# Altium project INA333信号放大模块.PrjPcb
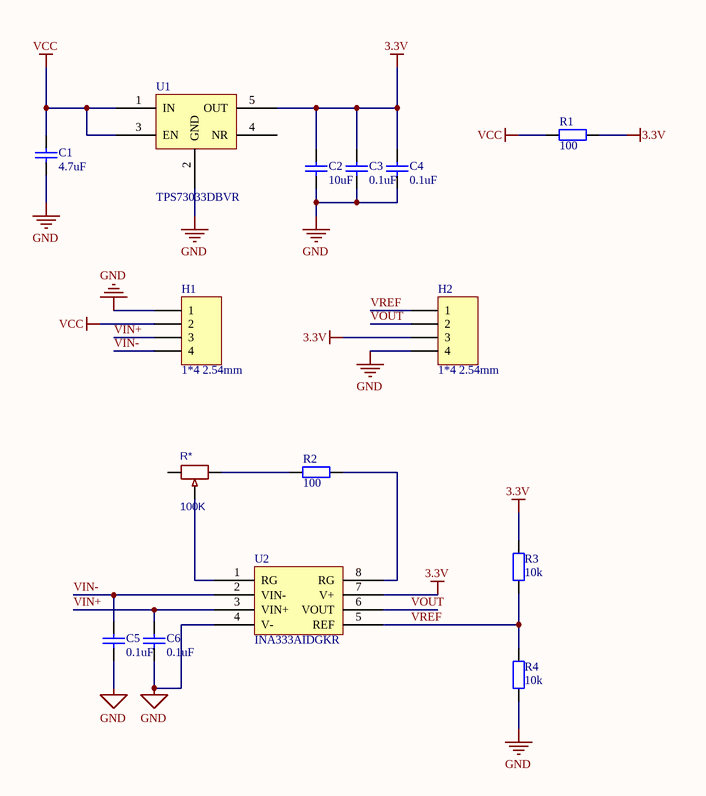
[diagram p0: INA333模块.SchDoc]
1 sheet, 15 parts. Net scope: global (net labels, ports and power ports of the same name join across sheets).
Board file: INA333模块.PcbDoc

## Sheet INA333模块.SchDoc
size A4

### Parts
C1  4.7uF  [0805_C]
C2  10uF  [0805_C]
C3  0.1uF  [0805_C]
C4  0.1uF  [0805_C]
C5  0.1uF  [0805_C]
C6  0.1uF  [0805_C]
H1  1*4 2.54mm  [HDR1X4]
H2  1*4 2.54mm  [HDR1X4]
R1  100  [0805_R]
R2  100  [0805_R]
R3  10k  [0805_R]
R4  10k  [0805_R]
R*  100K  [RES-ADJ-TH_3P-L9.5-W4.9-P2.50-L_3296W]
U1  TPS73033DBVR  [SOT-23-5]
U2  INA333AIDGKR  [MSOP-8]

### Nets
3.3V: C2.2 C3.2 C4.2 H2.3 R1.2 R3.1 U1.5(OUT) U2.7(V+)
GND: C1.1 C2.1 C3.1 C4.1 C5.1 C6.1 H1.1 H2.4 R4.2 U1.2(GND) U2.4(V-)
VCC: C1.2 H1.2 R1.1 U1.1(IN) U1.3(EN)
VIN+: C6.2 H1.3 U2.3(VIN+)
VIN-: C5.2 H1.4 U2.2(VIN-)
VOUT: H2.2 U2.6(VOUT)
VREF: H2.1 R3.2 R4.1 U2.5(REF)
NetR2_1: R2.1 U2.8(RG)
NetR2_2: R2.2 R*.1
NetR*_2: R*.2 U2.1(RG)

Not connected (* = marked no-connect by the designer): R* 3; U1 4(NR)

### Library data of the parts
C1-C6 = C_非极性电容: ComponentLink1Description: 供应商链接; ComponentLink1URL: http://www.szlcsc.com/product/details_8509.html; Package: 0805; Supplier: LC; SuppliersPartNumber: C8031
R1-R4 = R: 贴片电阻; ComponentLink1Description: 供应商链接; ComponentLink1URL: http://www.szlcsc.com/product/details_18202.html; Package: 0805; Supplier: LC; SuppliersPartNumber: C17514
R* = R_可调: BOM_Manufacturer: Chengdu Guosheng Tech; BOM_Manufacturer Part: 3296W-1-100; Resistance(Ohms): 10; nameAlias: Resistance (Ohms); Contributor: LCSC; BOM_Supplier: LCSC; BOM_Supplier Part: C118900; spicePre: R; spiceSymbolName: 3296W-1-100
U1 = TPS73033DBVR: SOT23-5
U2 = INA333AIDGKR: MSOP-8
H1 H2 = 1*4 2.54mm: LatestRevisionDate: 17-Jul-2002; LatestRevisionNote: Re-released for DXP Platform.; Publisher: Altium Limited